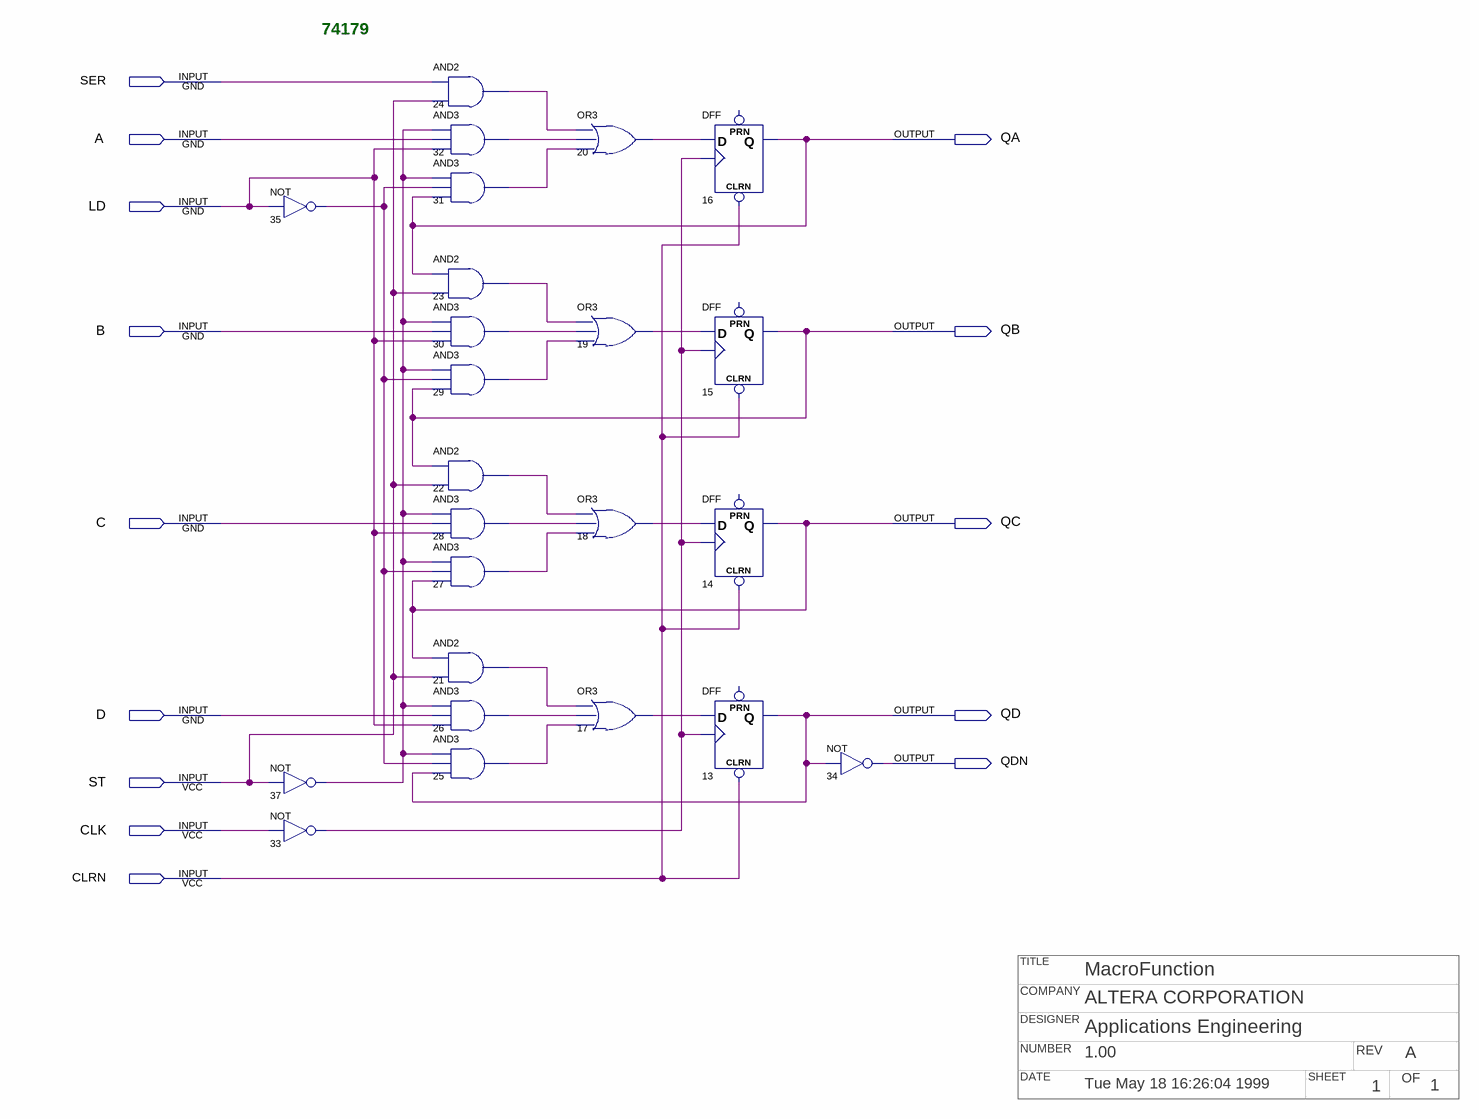
[diagram p0: schematic sheet]
// Quartus schematic 74179.bdf as structural Verilog: 24 symbols, 14 pins
// Title block: TITLE: MacroFunction; COMPANY: ALTERA CORPORATION; DESIGNER: Applications Engineering; NUMBER: 1.00; REV: A; DATE: Tue May 18 16:26:04 1999; SHEET: 1; OF: 1
module \74179  (
  input  SER,
  input  A,
  input  LD,
  input  B,
  input  C,
  input  D,
  input  ST,
  input  CLK,
  input  CLRN,
  output QA,
  output QB,
  output QC,
  output QD,
  output QDN
);

  wire n17_out, n18_out, n19_out, n20_out, n21_out, n22_out, n23_out, n24_out, n25_out, n26_out, n27_out,
       n28_out, n29_out, n30_out, n31_out, n32_out, n33_out, n35_out, n37_out;

  not u_35 (n35_out, LD);
  not u_37 (n37_out, ST);
  not u_33 (n33_out, CLK);
  and u_24 (n24_out, SER, ST);
  and u_32 (n32_out, n37_out, A, LD);
  and u_31 (n31_out, n37_out, n35_out, QA);
  and u_23 (n23_out, QA, ST);
  and u_30 (n30_out, n37_out, B, LD);
  and u_29 (n29_out, n37_out, n35_out, QB);
  and u_22 (n22_out, QB, ST);
  and u_28 (n28_out, n37_out, C, LD);
  and u_27 (n27_out, n37_out, n35_out, QC);
  and u_21 (n21_out, QC, ST);
  and u_26 (n26_out, n37_out, D, LD);
  and u_25 (n25_out, n37_out, n35_out, QD);
  or u_20 (n20_out, n24_out, n32_out, n31_out);
  or u_19 (n19_out, n23_out, n30_out, n29_out);
  or u_18 (n18_out, n22_out, n28_out, n27_out);
  or u_17 (n17_out, n21_out, n26_out, n25_out);
  DFF u_16 (.CLRN(CLRN), .CLK(n33_out), .D(n20_out), .Q(QA));  // open: PRN
  DFF u_15 (.CLRN(CLRN), .CLK(n33_out), .D(n19_out), .Q(QB));  // open: PRN
  DFF u_14 (.CLRN(CLRN), .CLK(n33_out), .D(n18_out), .Q(QC));  // open: PRN
  DFF u_13 (.CLRN(CLRN), .CLK(n33_out), .D(n17_out), .Q(QD));  // open: PRN
  not u_34 (QDN, QD);

  // Notes on the sheet:
  //   74179
endmodule
